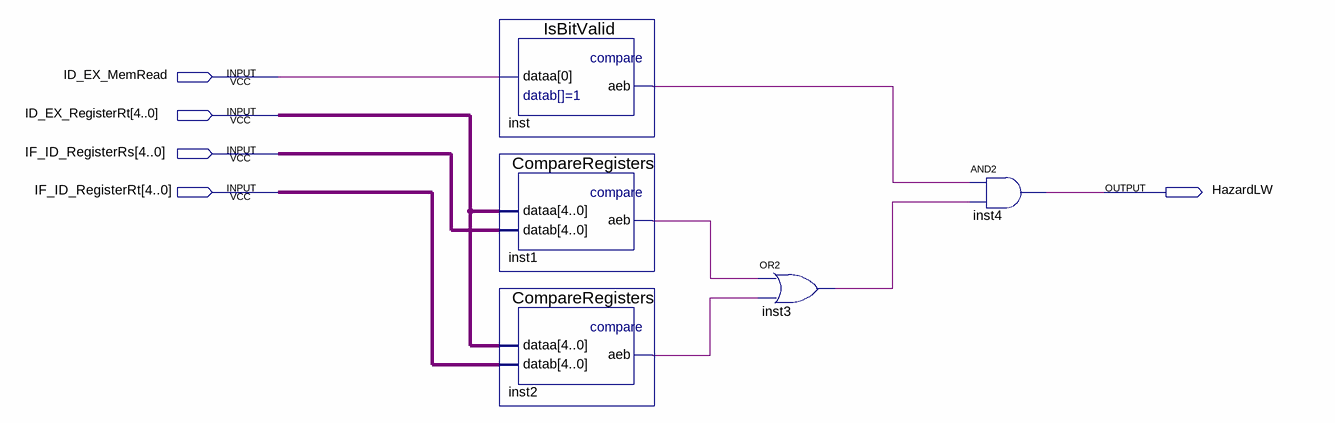
[diagram p0: schematic sheet]
// Quartus schematic HazardDetectionUnit.bdf as structural Verilog: 5 symbols, 5 pins
module HazardDetectionUnit (
  input  ID_EX_MemRead,
  input  [4:0] ID_EX_RegisterRt,
  input  [4:0] IF_ID_RegisterRs,
  input  [4:0] IF_ID_RegisterRt,
  output HazardLW
);

  wire inst1_aeb, inst2_aeb, inst3_out, inst_aeb;

  IsBitValid inst (.dataa(ID_EX_MemRead), .aeb(inst_aeb));
  CompareRegisters inst1 (.dataa(ID_EX_RegisterRt), .datab(IF_ID_RegisterRs), .aeb(inst1_aeb));
  CompareRegisters inst2 (.dataa(ID_EX_RegisterRt), .datab(IF_ID_RegisterRt), .aeb(inst2_aeb));
  or inst3 (inst3_out, inst1_aeb, inst2_aeb);
  and inst4 (HazardLW, inst_aeb, inst3_out);
endmodule
